# EAGLE schematic Inverter New (EAGLE 9.1.2)

## Sheet 1 of 3
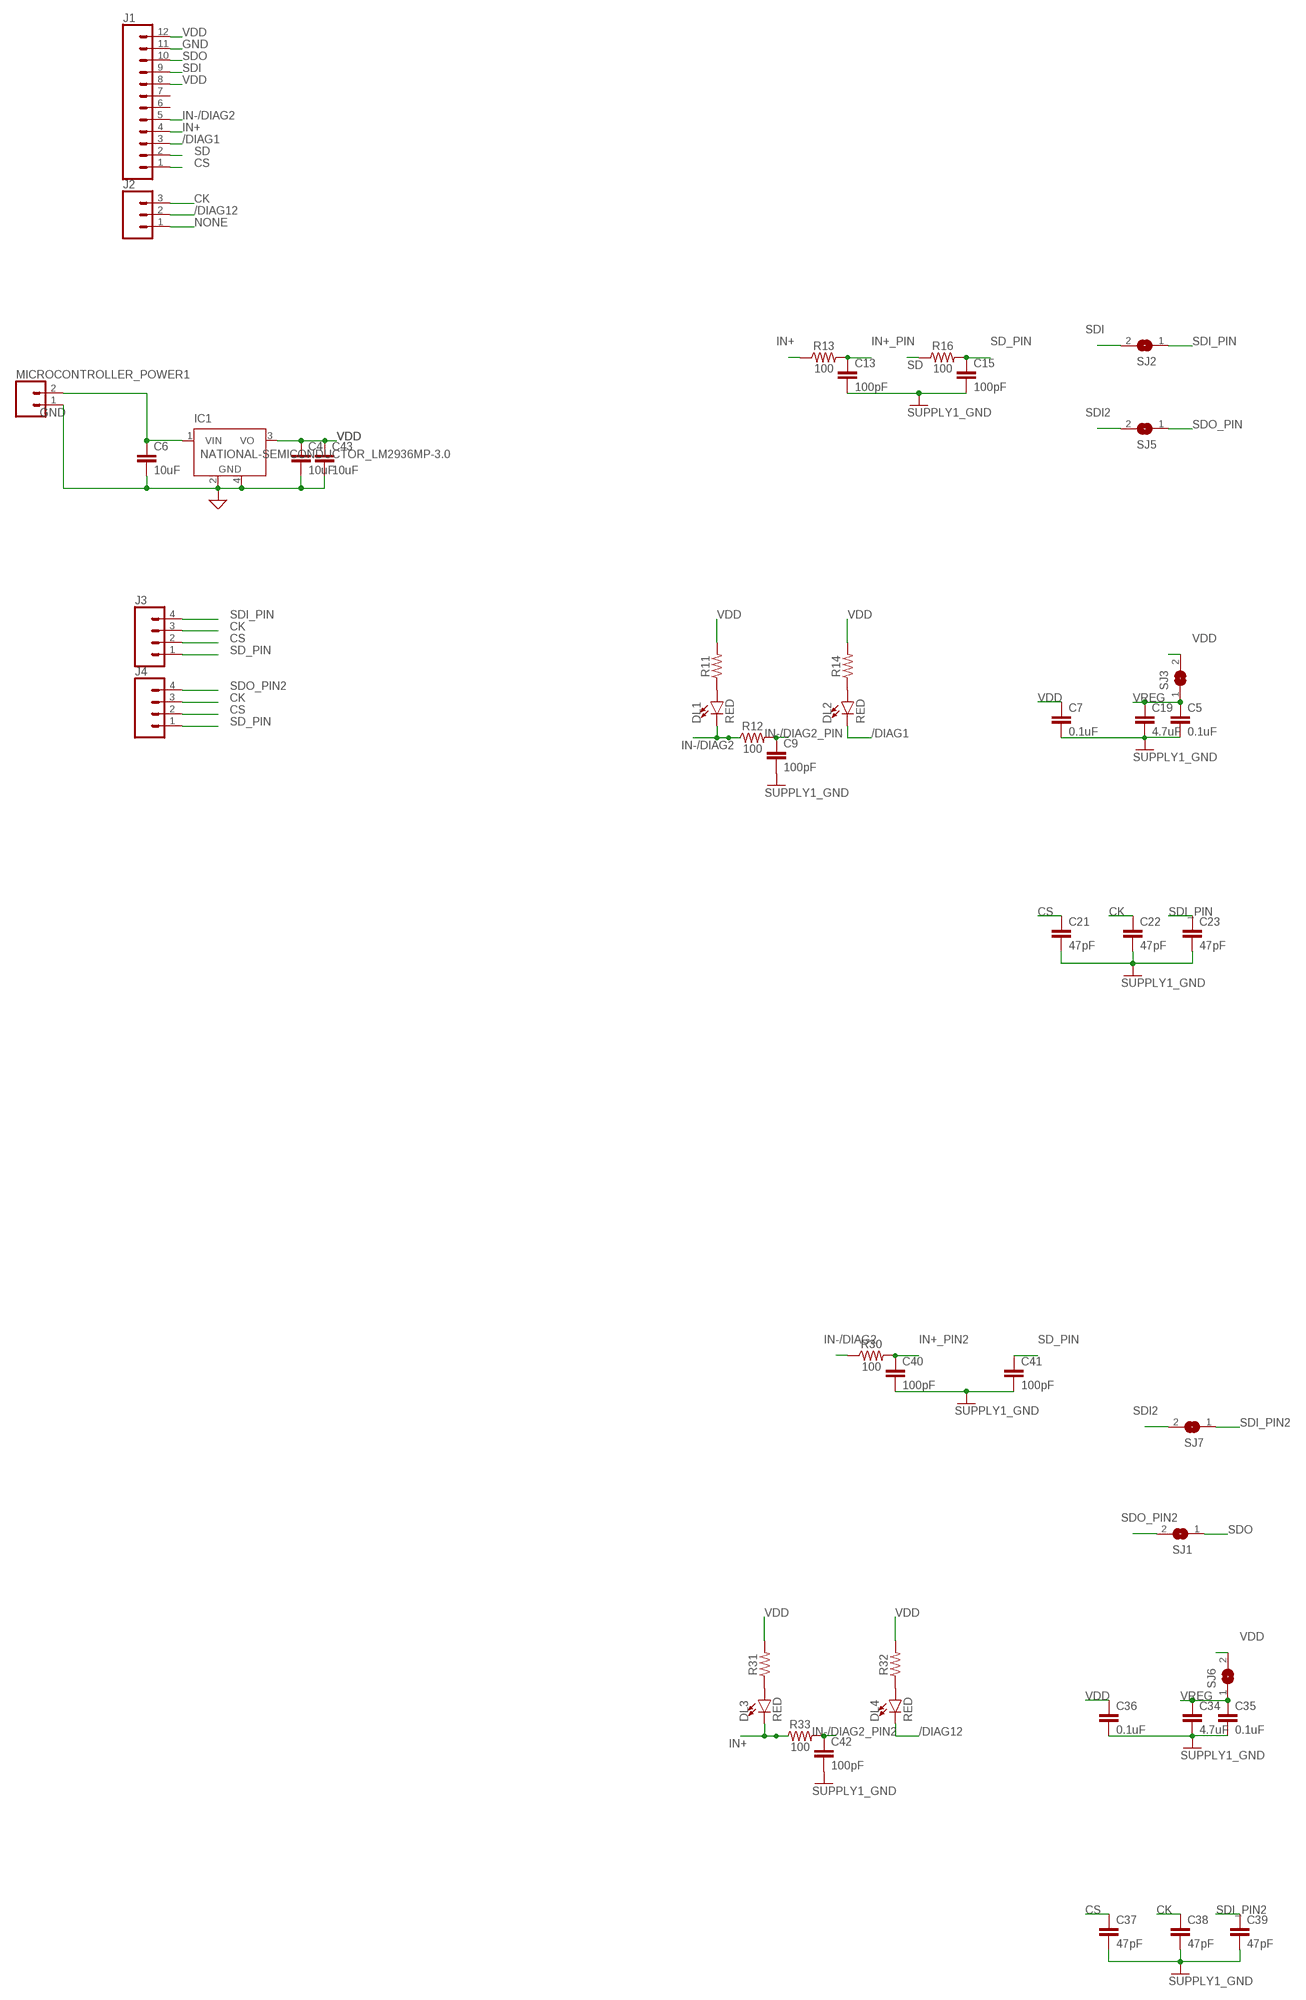
[diagram p0: schematic, sheet 1, part 1 of 2]
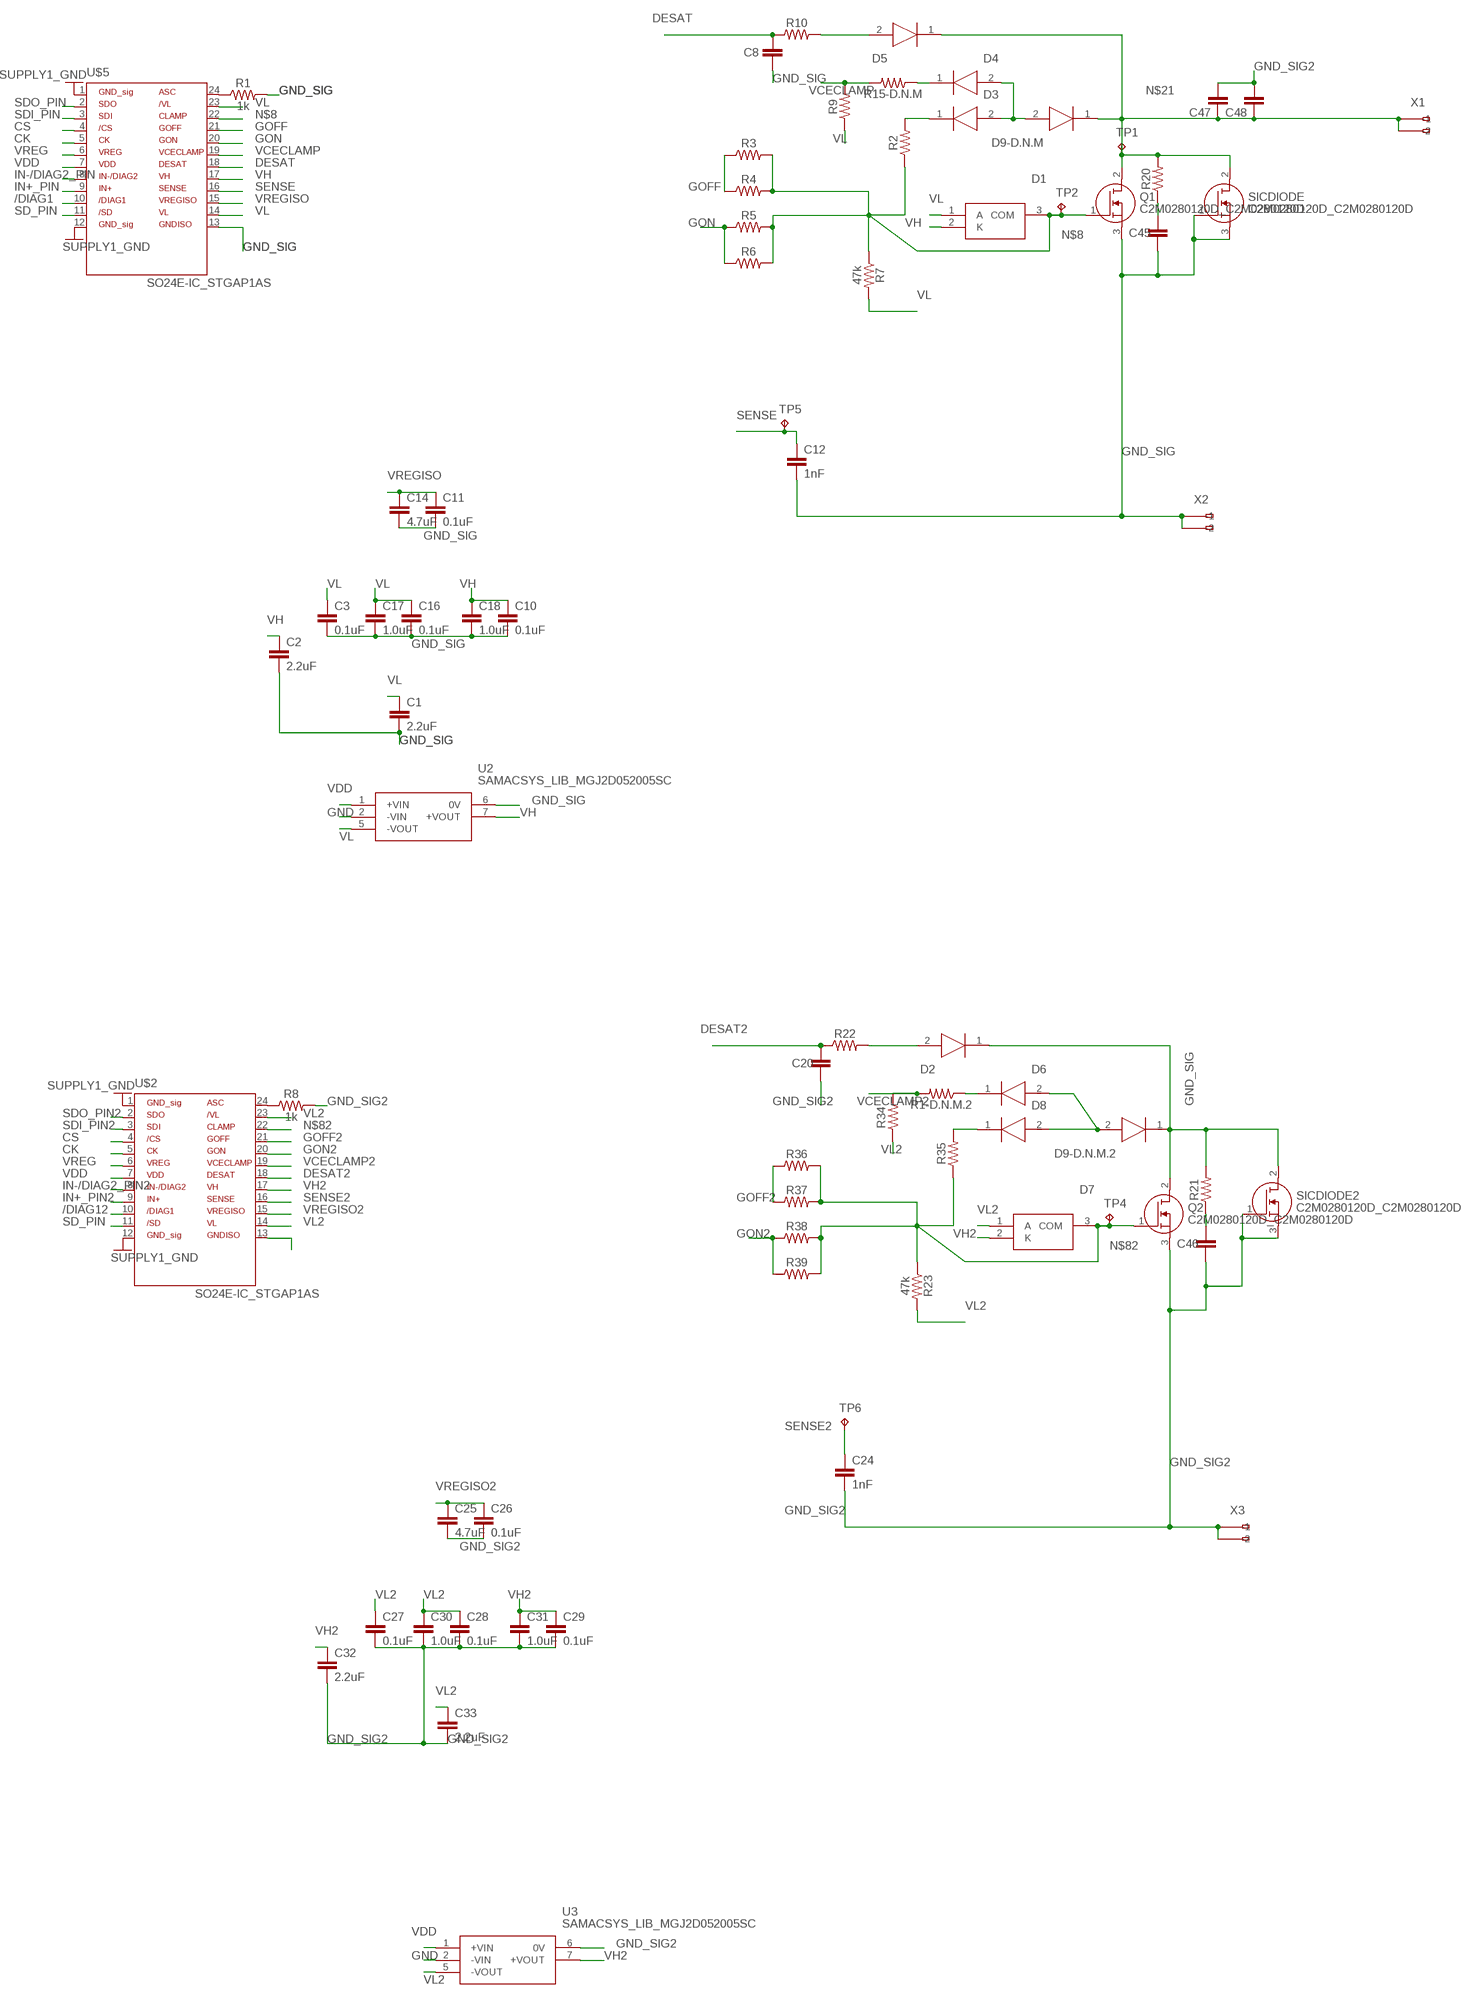
[diagram p1: schematic, sheet 1, part 2 of 2]

### Parts
C1  2.2uF  SPARKFUN-CAPACITORS_2.2UF-1206-50V-10%  [SPARKFUN-CAPACITORS_1206]
C2  2.2uF  SPARKFUN-CAPACITORS_2.2UF-1206-50V-10%  [SPARKFUN-CAPACITORS_1206]
C3  0.1uF  SPARKFUN-CAPACITORS_0.1UF-0603-100V-10%  [SPARKFUN-CAPACITORS_0603]
C4  10uF  SPARKFUN-CAPACITORS_10UF-1210-50V-20%  [SPARKFUN-CAPACITORS_1210]
C5  0.1uF  SPARKFUN-CAPACITORS_0.1UF-0603-100V-10%  [SPARKFUN-CAPACITORS_0603]
C6  10uF  SPARKFUN-CAPACITORS_10UF-1210-50V-20%  [SPARKFUN-CAPACITORS_1210]
C7  0.1uF  SPARKFUN-CAPACITORS_0.1UF-0603-100V-10%  [SPARKFUN-CAPACITORS_0603]
C8  100pF  SPARKFUN-CAPACITORS_100PF-0603-50V-5%  [SPARKFUN-CAPACITORS_0603]
C9  100pF  SPARKFUN-CAPACITORS_100PF-0603-50V-5%  [SPARKFUN-CAPACITORS_0603]
C10  0.1uF  SPARKFUN-CAPACITORS_0.1UF-0603-100V-10%  [SPARKFUN-CAPACITORS_0603]
C11  0.1uF  SPARKFUN-CAPACITORS_0.1UF-0603-100V-10%  [SPARKFUN-CAPACITORS_0603]
C12  1nF  SPARKFUN-CAPACITORS_1.0NF/1000PF-0603-50V-10%  [SPARKFUN-CAPACITORS_0603]
C13  100pF  SPARKFUN-CAPACITORS_100PF-0603-50V-5%  [SPARKFUN-CAPACITORS_0603]
C14  4.7uF  SPARKFUN-CAPACITORS_4.7UF0603  [SPARKFUN-CAPACITORS_0603]
C15  100pF  SPARKFUN-CAPACITORS_100PF-0603-50V-5%  [SPARKFUN-CAPACITORS_0603]
C16  0.1uF  SPARKFUN-CAPACITORS_0.1UF-0603-100V-10%  [SPARKFUN-CAPACITORS_0603]
C17  1.0uF  SPARKFUN-CAPACITORS_1.0UF-0805-25V-10%  [SPARKFUN-CAPACITORS_0805]
C18  1.0uF  SPARKFUN-CAPACITORS_1.0UF-0805-25V-10%  [SPARKFUN-CAPACITORS_0805]
C19  4.7uF  SPARKFUN-CAPACITORS_4.7UF0603  [SPARKFUN-CAPACITORS_0603]
C20  100pF  SPARKFUN-CAPACITORS_100PF-0603-50V-5%  [SPARKFUN-CAPACITORS_0603]
C21  47pF  SPARKFUN-CAPACITORS_47PF-0603-50V-5%  [SPARKFUN-CAPACITORS_0603]
C22  47pF  SPARKFUN-CAPACITORS_47PF-0603-50V-5%  [SPARKFUN-CAPACITORS_0603]
C23  47pF  SPARKFUN-CAPACITORS_47PF-0603-50V-5%  [SPARKFUN-CAPACITORS_0603]
C24  1nF  SPARKFUN-CAPACITORS_1.0NF/1000PF-0603-50V-10%  [SPARKFUN-CAPACITORS_0603]
C25  4.7uF  SPARKFUN-CAPACITORS_4.7UF0603  [SPARKFUN-CAPACITORS_0603]
C26  0.1uF  SPARKFUN-CAPACITORS_0.1UF-0603-100V-10%  [SPARKFUN-CAPACITORS_0603]
C27  0.1uF  SPARKFUN-CAPACITORS_0.1UF-0603-100V-10%  [SPARKFUN-CAPACITORS_0603]
C28  0.1uF  SPARKFUN-CAPACITORS_0.1UF-0603-100V-10%  [SPARKFUN-CAPACITORS_0603]
C29  0.1uF  SPARKFUN-CAPACITORS_0.1UF-0603-100V-10%  [SPARKFUN-CAPACITORS_0603]
C30  1.0uF  SPARKFUN-CAPACITORS_1.0UF-0805-25V-10%  [SPARKFUN-CAPACITORS_0805]
C31  1.0uF  SPARKFUN-CAPACITORS_1.0UF-0805-25V-10%  [SPARKFUN-CAPACITORS_0805]
C32  2.2uF  SPARKFUN-CAPACITORS_2.2UF-1206-50V-10%  [SPARKFUN-CAPACITORS_1206]
C33  2.2uF  SPARKFUN-CAPACITORS_2.2UF-1206-50V-10%  [SPARKFUN-CAPACITORS_1206]
C34  4.7uF  SPARKFUN-CAPACITORS_4.7UF0603  [SPARKFUN-CAPACITORS_0603]
C35  0.1uF  SPARKFUN-CAPACITORS_0.1UF-0603-100V-10%  [SPARKFUN-CAPACITORS_0603]
C36  0.1uF  SPARKFUN-CAPACITORS_0.1UF-0603-100V-10%  [SPARKFUN-CAPACITORS_0603]
C37  47pF  SPARKFUN-CAPACITORS_47PF-0603-50V-5%  [SPARKFUN-CAPACITORS_0603]
C38  47pF  SPARKFUN-CAPACITORS_47PF-0603-50V-5%  [SPARKFUN-CAPACITORS_0603]
C39  47pF  SPARKFUN-CAPACITORS_47PF-0603-50V-5%  [SPARKFUN-CAPACITORS_0603]
C40  100pF  SPARKFUN-CAPACITORS_100PF-0603-50V-5%  [SPARKFUN-CAPACITORS_0603]
C41  100pF  SPARKFUN-CAPACITORS_100PF-0603-50V-5%  [SPARKFUN-CAPACITORS_0603]
C42  100pF  SPARKFUN-CAPACITORS_100PF-0603-50V-5%  [SPARKFUN-CAPACITORS_0603]
C43  10uF  SPARKFUN-CAPACITORS_10UF-1210-50V-20%  [SPARKFUN-CAPACITORS_1210]
C45  100pF  SPARKFUN-CAPACITORS_100PF-0603-50V-5%  [SPARKFUN-CAPACITORS_0603]
C46  100pF  SPARKFUN-CAPACITORS_100PF-0603-50V-5%  [SPARKFUN-CAPACITORS_0603]
C47  C-EU225-062X268  [C225-062X268]
C48  C-EU225-062X268  [C225-062X268]
D1  BAT54SFILM_BAT54SFILM  [BAT54SFILM_SOT105P242X150-3N]
D2  STTH112A_STTH112A  [STTH112A_DIOM5126X265N]
D3  STPS2H100A_STPS2H100A  [STPS2H100A_DIOM5126X265N]
D4  BAT20JFILM_BAT20JFILM  [BAT20JFILM_SOD2512X113N]
D5  STTH112A_STTH112A  [STTH112A_DIOM5126X265N]
D6  BAT20JFILM_BAT20JFILM  [BAT20JFILM_SOD2512X113N]
D7  BAT54SFILM_BAT54SFILM  [BAT54SFILM_SOT105P242X150-3N]
D8  STPS2H100A_STPS2H100A  [STPS2H100A_DIOM5126X265N]
D9-D.N.M  STPS2H100A_STPS2H100A  [STPS2H100A_DIOM5126X265N]
D9-D.N.M.2  STPS2H100A_STPS2H100A  [STPS2H100A_DIOM5126X265N]
DL1  RED  SPARKFUN-LED_LED-RED1206  [SPARKFUN-LED_LED-1206]
DL2  RED  SPARKFUN-LED_LED-RED1206  [SPARKFUN-LED_LED-1206]
DL3  RED  SPARKFUN-LED_LED-RED1206  [SPARKFUN-LED_LED-1206]
DL4  RED  SPARKFUN-LED_LED-RED1206  [SPARKFUN-LED_LED-1206]
IC1  NATIONAL-SEMICONDUCTOR_LM2936MP-3.0  [NATIONAL-SEMICONDUCTOR_SOT223]
J1  SPARKFUN-CONNECTORS_CONN_12LONGPADS  [SPARKFUN-CONNECTORS_1X12_LONGPADS]
J2  SPARKFUN-CONNECTORS_CONN_03LONGPADS  [SPARKFUN-CONNECTORS_1X03_LONGPADS]
J3  SPARKFUN-CONNECTORS_CONN_04LONGPADS  [SPARKFUN-CONNECTORS_1X04_LONGPADS]
J4  SPARKFUN-CONNECTORS_CONN_04LONGPADS  [SPARKFUN-CONNECTORS_1X04_LONGPADS]
MICROCONTROLLER_POWER1  SPARKFUN-CONNECTORS_CONN_025MM  [SPARKFUN-CONNECTORS_SCREWTERMINAL-5MM-2]
Q1  C2M0280120D_C2M0280120D  [C2M0280120D_TO544P521X1594X2550-3P]
Q2  C2M0280120D_C2M0280120D  [C2M0280120D_TO544P521X1594X2550-3P]
R1  1k  SPARKFUN-RESISTORS_1KOHM-0603-1/10W-1%  [SPARKFUN-RESISTORS_0603]
R1-D.N.M.2  0  SPARKFUN-RESISTORS_0OHM-0603-1/10W-5%  [SPARKFUN-RESISTORS_0603]
R2  SPARKFUN-RESISTORS_RESISTOR0805  [SPARKFUN-RESISTORS_0805]
R3  SPARKFUN-RESISTORS_RESISTOR1206  [SPARKFUN-RESISTORS_1206]
R4  SPARKFUN-RESISTORS_RESISTOR1206  [SPARKFUN-RESISTORS_1206]
R5  SPARKFUN-RESISTORS_RESISTOR1206  [SPARKFUN-RESISTORS_1206]
R6  SPARKFUN-RESISTORS_RESISTOR1206  [SPARKFUN-RESISTORS_1206]
R7  47k  SPARKFUN-RESISTORS_47KOHM-0603-1/10W-1%  [SPARKFUN-RESISTORS_0603]
R8  1k  SPARKFUN-RESISTORS_1KOHM-0603-1/10W-1%  [SPARKFUN-RESISTORS_0603]
R9  0  SPARKFUN-RESISTORS_0OHM-0603-1/10W-5%  [SPARKFUN-RESISTORS_0603]
R10  1k  SPARKFUN-RESISTORS_1KOHM-0603-1/10W-1%  [SPARKFUN-RESISTORS_0603]
R11  SPARKFUN-RESISTORS_RESISTOR0603  [SPARKFUN-RESISTORS_0603]
R12  100  SPARKFUN-RESISTORS_100OHM-0603-1/4W-5%  [SPARKFUN-RESISTORS_0603]
R13  100  SPARKFUN-RESISTORS_100OHM-0603-1/4W-5%  [SPARKFUN-RESISTORS_0603]
R14  SPARKFUN-RESISTORS_RESISTOR0603  [SPARKFUN-RESISTORS_0603]
R15-D.N.M  0  SPARKFUN-RESISTORS_0OHM-0603-1/10W-5%  [SPARKFUN-RESISTORS_0603]
R16  100  SPARKFUN-RESISTORS_100OHM-0603-1/4W-5%  [SPARKFUN-RESISTORS_0603]
R20  SPARKFUN-RESISTORS_RESISTOR1206  [SPARKFUN-RESISTORS_1206]
R21  SPARKFUN-RESISTORS_RESISTOR1206  [SPARKFUN-RESISTORS_1206]
R22  1k  SPARKFUN-RESISTORS_1KOHM-0603-1/10W-1%  [SPARKFUN-RESISTORS_0603]
R23  47k  SPARKFUN-RESISTORS_47KOHM-0603-1/10W-1%  [SPARKFUN-RESISTORS_0603]
R30  100  SPARKFUN-RESISTORS_100OHM-0603-1/4W-5%  [SPARKFUN-RESISTORS_0603]
R31  SPARKFUN-RESISTORS_RESISTOR0603  [SPARKFUN-RESISTORS_0603]
R32  SPARKFUN-RESISTORS_RESISTOR0603  [SPARKFUN-RESISTORS_0603]
R33  100  SPARKFUN-RESISTORS_100OHM-0603-1/4W-5%  [SPARKFUN-RESISTORS_0603]
R34  0  SPARKFUN-RESISTORS_0OHM-0603-1/10W-5%  [SPARKFUN-RESISTORS_0603]
R35  SPARKFUN-RESISTORS_RESISTOR0805  [SPARKFUN-RESISTORS_0805]
R36  SPARKFUN-RESISTORS_RESISTOR1206  [SPARKFUN-RESISTORS_1206]
R37  SPARKFUN-RESISTORS_RESISTOR1206  [SPARKFUN-RESISTORS_1206]
R38  SPARKFUN-RESISTORS_RESISTOR1206  [SPARKFUN-RESISTORS_1206]
R39  SPARKFUN-RESISTORS_RESISTOR1206  [SPARKFUN-RESISTORS_1206]
SICDIODE  C2M0280120D_C2M0280120D  [C2M0280120D_TO544P521X1594X2550-3P]
SICDIODE2  C2M0280120D_C2M0280120D  [C2M0280120D_TO544P521X1594X2550-3P]
SJ1  JUMPER_SJ  [JUMPER_SJ]
SJ2  JUMPER_SJ  [JUMPER_SJ]
SJ3  JUMPER_SJ  [JUMPER_SJ]
SJ5  JUMPER_SJ  [JUMPER_SJ]
SJ6  JUMPER_SJ  [JUMPER_SJ]
SJ7  JUMPER_SJ  [JUMPER_SJ]
TP1  TPTP15SQ  [TP15SQ]
TP2  TPTP15SQ  [TP15SQ]
TP4  TPTP15SQ  [TP15SQ]
TP5  TPTP15SQ  [TP15SQ]
TP6  TPTP15SQ  [TP15SQ]
U2  SAMACSYS_LIB_MGJ2D052005SC  [SAMACSYS_LIB_MGJ2D_7-PIN-SIP]
U3  SAMACSYS_LIB_MGJ2D052005SC  [SAMACSYS_LIB_MGJ2D_7-PIN-SIP]
U$2  SO24E-IC_STGAP1AS  [SO24E-IC_SO24W]
U$5  SO24E-IC_STGAP1AS  [SO24E-IC_SO24W]
X1  234-502  [234-502]
X2  234-502  [234-502]
X3  234-502  [234-502]

### Nets
/DIAG1: DL2.C J1.3 U$5.10(/DIAG1)
/DIAG12: DL4.C J2.2 U$2.10(/DIAG1)
CK: C22.1 C38.1 J2.3 J3.3 J4.3 U$2.5(CK) U$5.5(CK)
CS: C21.1 C37.1 J1.1 J3.2 J4.2 U$2.4(/CS) U$5.4(/CS)
DESAT: C8.1 R10.1 U$5.18(DESAT)
DESAT2: C20.1 R22.1 U$2.18(DESAT)
GND: C4.2 C5.2 C6.2 C7.2 C9.2 C13.2 C15.2 C19.2 C21.2 C22.2 C23.2 C34.2 C35.2 C36.2 C37.2 C38.2 C39.2 C40.2 C41.2 C42.2 C43.2 IC1.2(GND) IC1.4(GND) J1.11 MICROCONTROLLER_POWER1.1 U2.2(-VIN) U3.2(-VIN) U$2.1(GND_SIG) U$2.12(GND_SIG) U$5.1(GND_SIG) U$5.12(GND_SIG) ; supply symbol labelled SUPPLY1_GND, SUP ; also sheet 2
GND_SIG: C1.2 C2.2 C3.2 C8.2 C10.2 C11.2 C12.2 C14.2 C16.2 C17.2 C18.2 C45.2 D2.1(K) D9-D.N.M.2.1(K) Q1.3(S) Q2.2(D) R1.2 R21.2 SICDIODE2.2(D) SICDIODE.1(G) SICDIODE.3(S) U2.6(0V) U$5.13(GNDISO) X2.A1(-1) X2.A2(-2)
GND_SIG2: C20.2 C24.2 C25.2 C26.2 C27.2 C28.2 C29.2 C30.2 C31.2 C32.2 C33.2 C46.2 C47.2 C48.2 Q2.3(S) R8.2 SICDIODE2.1(G) SICDIODE2.3(S) U3.6(0V) U$2.13(GNDISO) X3.A1(-1) X3.A2(-2)
GOFF: R3.1 R4.1 U$5.21(GOFF)
GOFF2: R36.1 R37.1 U$2.21(GOFF)
GON: R5.1 R6.1 U$5.20(GON)
GON2: R38.1 R39.1 U$2.20(GON)
IN+: DL3.C J1.4 R13.1 R33.1
IN+_PIN: C13.1 R13.2 U$5.9(IN+)
IN+_PIN2: C40.1 R30.2 U$2.9(IN+)
IN-/DIAG2: DL1.C J1.5 R12.1 R30.1
IN-/DIAG2_PIN: C9.1 R12.2 U$5.8(IN-/DIAG2)
IN-/DIAG2_PIN2: C42.1 R33.2 U$2.8(IN-/DIAG2)
N$1: R1.1 U$5.24(ASC)
N$2: DL1.A R11.1
N$3: DL2.A R14.1
N$4: D5.2(A) R10.2
N$5: D2.2(A) R22.2
N$7: D3.1(K) R2.2
N$8: D1.3(COM) Q1.1(G) R2.1 R3.2 R4.2 R5.2 R6.2 R7.1 TP2.TP U$5.22(CLAMP)
N$11: C6.1 IC1.1(VIN) MICROCONTROLLER_POWER1.2
N$12: D8.1(K) R35.2
N$13: R8.1 U$2.24(ASC)
N$14: DL3.A R31.1
N$15: DL4.A R32.1
N$16: D4.1(K) R15-D.N.M.1
N$18: D3.2(A) D4.2(A) D9-D.N.M.2(A)
N$19: D6.1(K) R1-D.N.M.2.1
N$20: D6.2(A) D8.2(A) D9-D.N.M.2.2(A)
N$21: C47.1 C48.1 D5.1(K) D9-D.N.M.1(K) Q1.2(D) R20.2 SICDIODE.2(D) TP1.TP X1.A1(-1) X1.A2(-2)
N$28: C45.1 R20.1
N$32: C46.1 R21.1
N$82: D7.3(COM) Q2.1(G) R23.1 R35.1 R36.2 R37.2 R38.2 R39.2 TP4.TP U$2.22(CLAMP)
NONE: J2.1
SD: J1.2 R16.1
SD_PIN: C15.1 C41.1 J3.1 J4.1 R16.2 U$2.11(/SD) U$5.11(/SD)
SDI: J1.9 SJ2.2
SDI2: SJ5.2 SJ7.2
SDI_PIN: C23.1 J3.4 SJ2.1 U$5.3(SDI)
SDI_PIN2: C39.1 SJ7.1 U$2.3(SDI)
SDO: J1.10 SJ1.1
SDO_PIN: SJ5.1 U$5.2(SDO)
SDO_PIN2: J4.4 SJ1.2 U$2.2(SDO) ; also sheet 2
SENSE: C12.1 TP5.TP U$5.16(SENSE)
SENSE2: C24.1 TP6.TP U$2.16(SENSE)
VCECLAMP: R9.2 R15-D.N.M.2 U$5.19(VCECLAMP)
VCECLAMP2: R1-D.N.M.2.2 R34.2 U$2.19(VCECLAMP)
VDD: C4.1 C7.1 C36.1 C43.1 IC1.3(VO) J1.8 J1.12 R11.2 R14.2 R31.2 R32.2 SJ3.2 SJ6.2 U2.1(+VIN) U3.1(+VIN) U$2.7(VDD) U$5.7(VDD) ; also sheet 2
VH: C2.1 C10.1 C18.1 D1.2(K) U2.7(+VOUT) U$5.17(VH)
VH2: C29.1 C31.1 C32.1 D7.2(K) U3.7(+VOUT) U$2.17(VH)
VL: C1.1 C3.1 C16.1 C17.1 D1.1(A) R7.2 R9.1 U2.5(-VOUT) U$5.14(VL) U$5.23(VL)
VL2: C27.1 C28.1 C30.1 C33.1 D7.1(A) R23.2 R34.1 U3.5(-VOUT) U$2.14(VL) U$2.23(VL)
VREG: C5.1 C19.1 C34.1 C35.1 SJ3.1 SJ6.1 U$2.6(VREG) U$5.6(VREG)
VREGISO: C11.1 C14.1 U$5.15(VREGISO)
VREGISO2: C25.1 C26.1 U$2.15(VREGISO)
Unconnected: J1.6 J1.7 X1.B1(B-1) X1.B2(B-2) X2.B1(B-1) X2.B2(B-2) X3.B1(B-1) X3.B2(B-2)

## Sheet 2 of 3
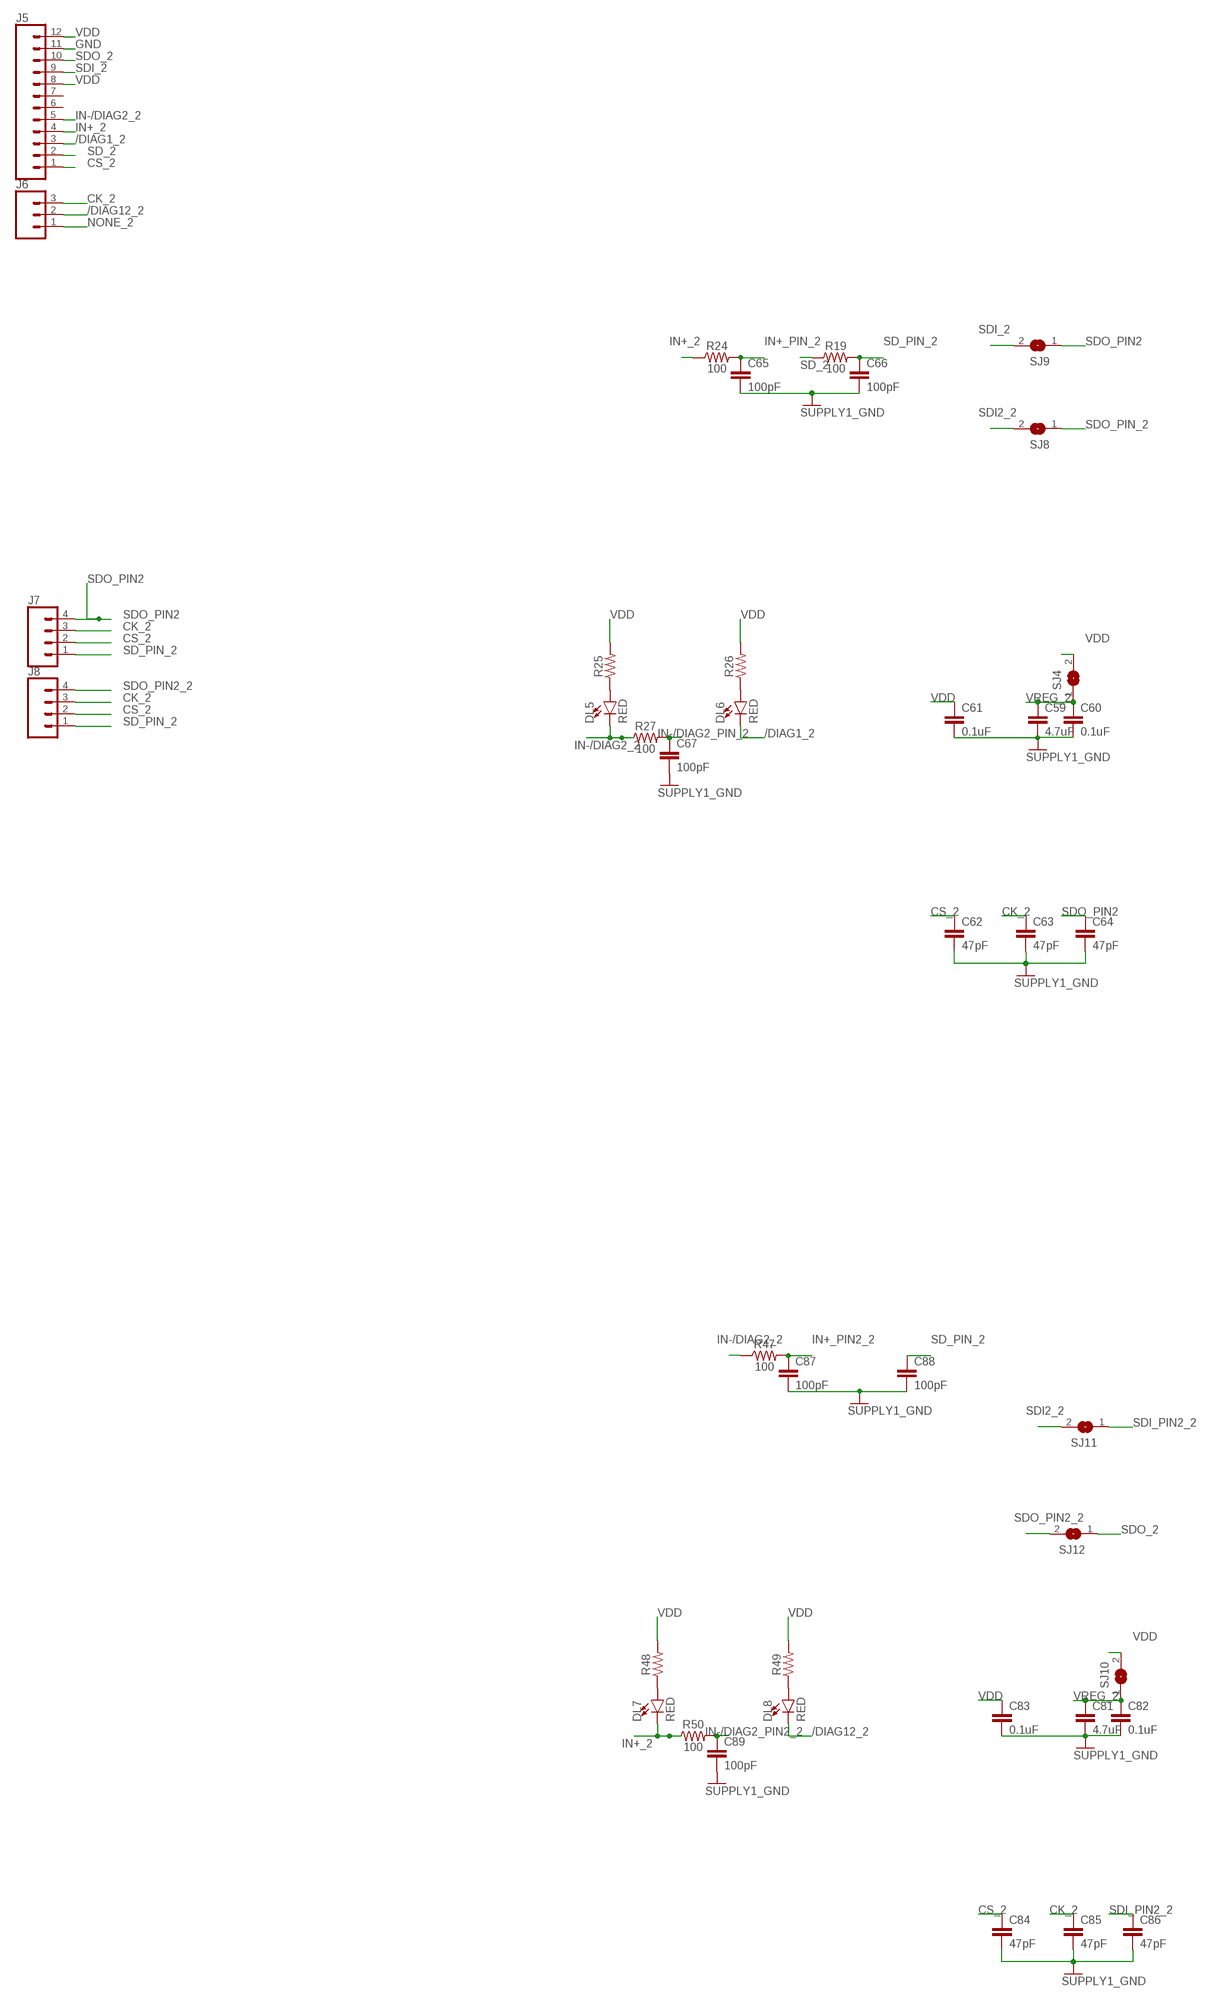
[diagram p2: schematic, sheet 2, part 1 of 2]
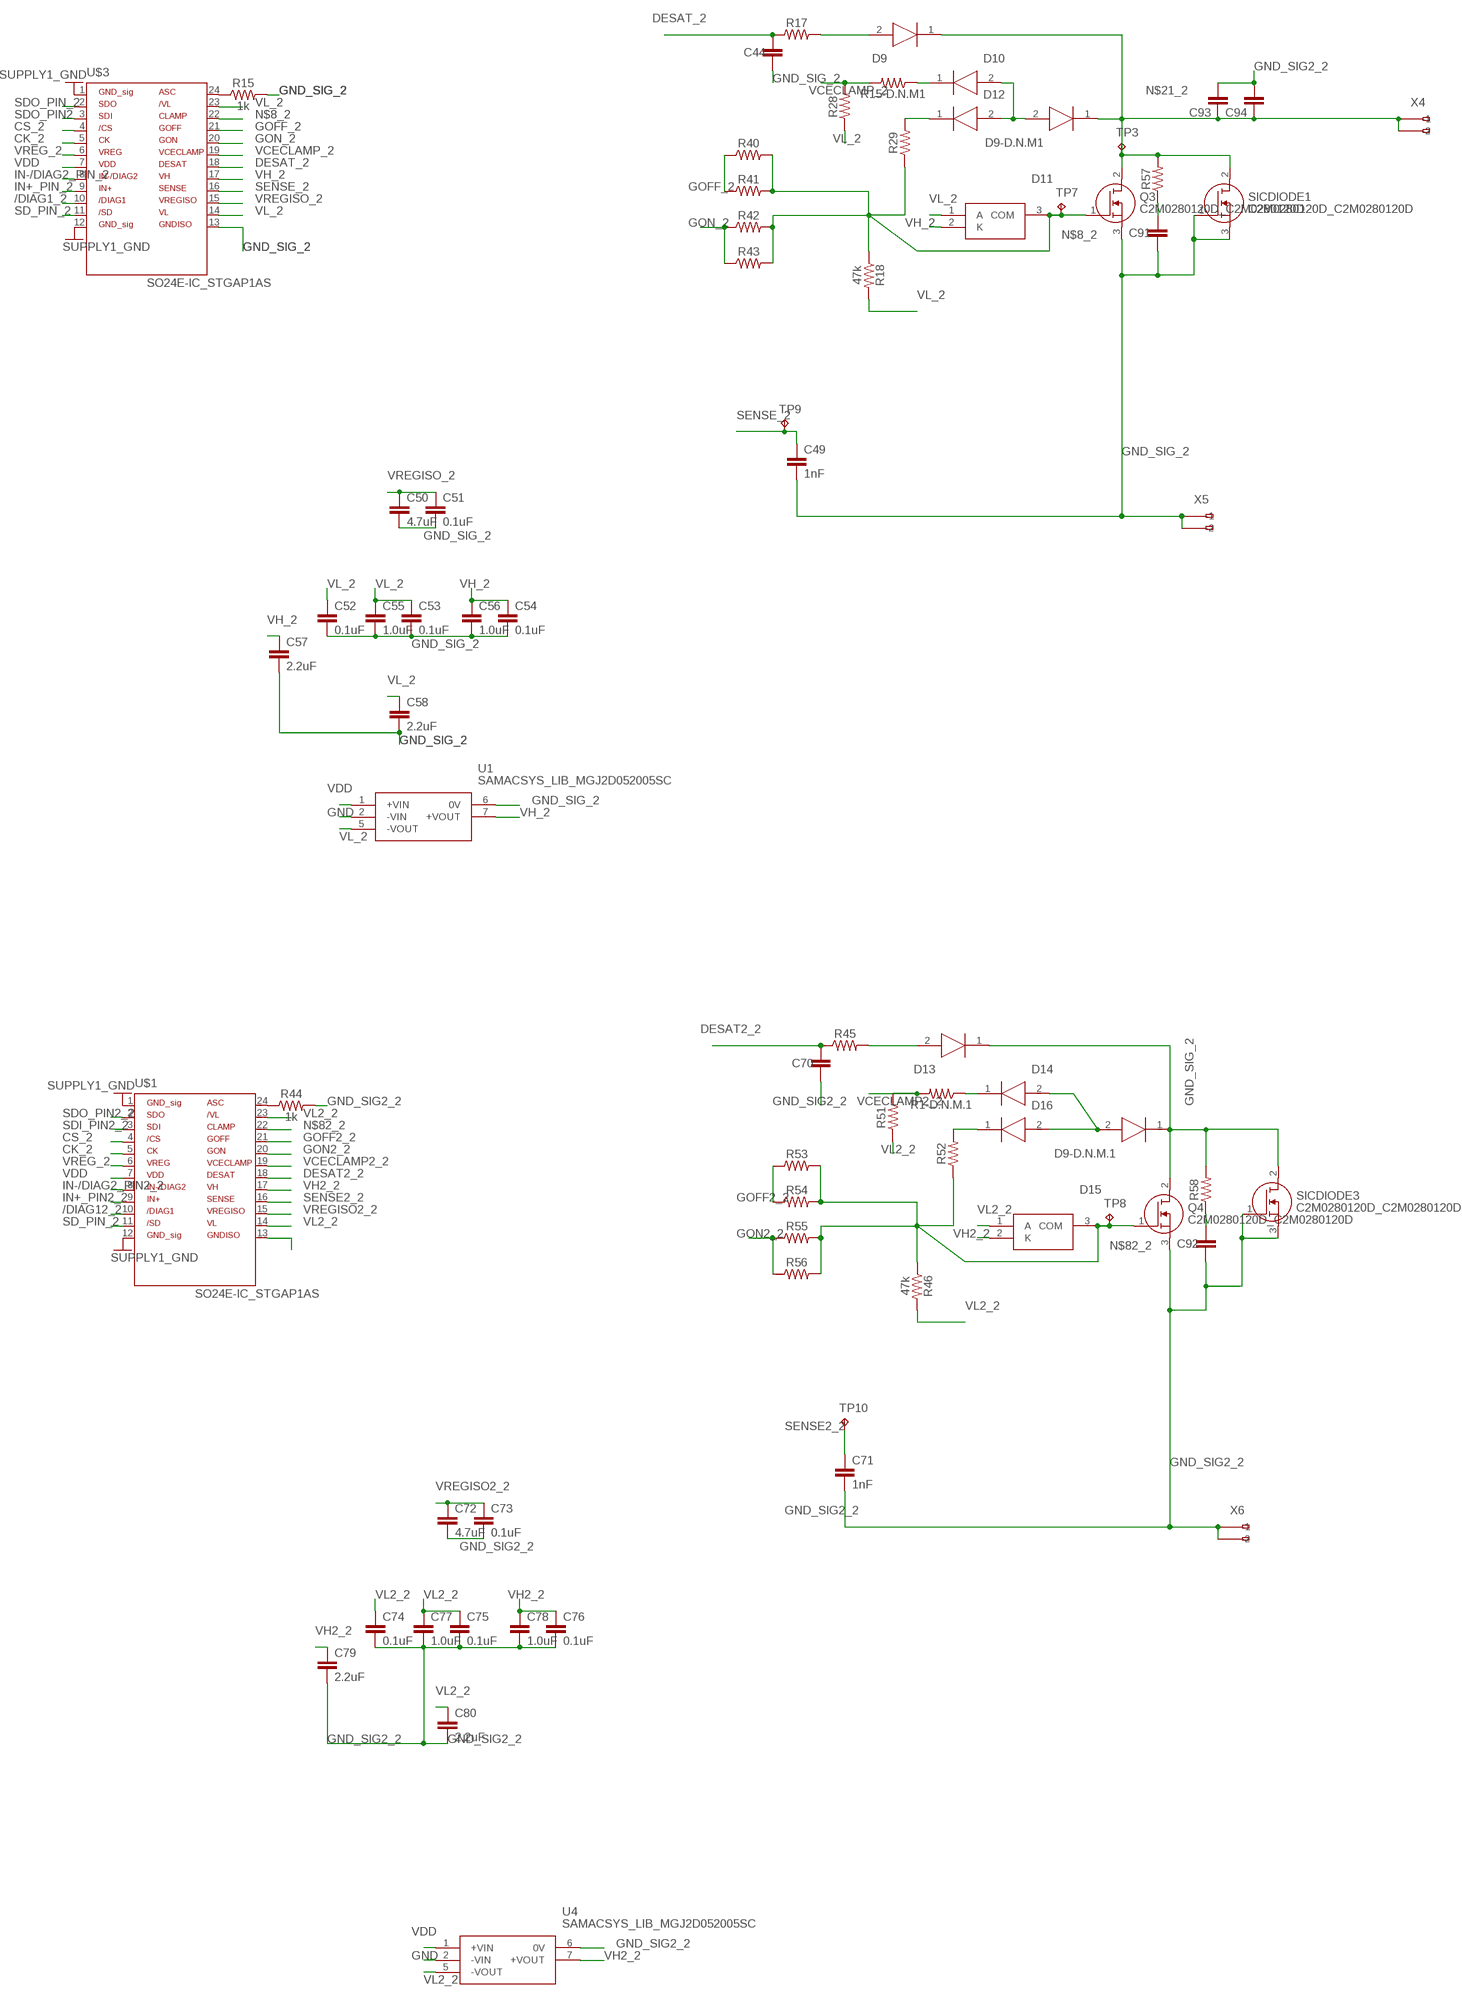
[diagram p3: schematic, sheet 2, part 2 of 2]

### Parts
C44  100pF  SPARKFUN-CAPACITORS_100PF-0603-50V-5%  [SPARKFUN-CAPACITORS_0603]
C49  1nF  SPARKFUN-CAPACITORS_1.0NF/1000PF-0603-50V-10%  [SPARKFUN-CAPACITORS_0603]
C50  4.7uF  SPARKFUN-CAPACITORS_4.7UF0603  [SPARKFUN-CAPACITORS_0603]
C51  0.1uF  SPARKFUN-CAPACITORS_0.1UF-0603-100V-10%  [SPARKFUN-CAPACITORS_0603]
C52  0.1uF  SPARKFUN-CAPACITORS_0.1UF-0603-100V-10%  [SPARKFUN-CAPACITORS_0603]
C53  0.1uF  SPARKFUN-CAPACITORS_0.1UF-0603-100V-10%  [SPARKFUN-CAPACITORS_0603]
C54  0.1uF  SPARKFUN-CAPACITORS_0.1UF-0603-100V-10%  [SPARKFUN-CAPACITORS_0603]
C55  1.0uF  SPARKFUN-CAPACITORS_1.0UF-0805-25V-10%  [SPARKFUN-CAPACITORS_0805]
C56  1.0uF  SPARKFUN-CAPACITORS_1.0UF-0805-25V-10%  [SPARKFUN-CAPACITORS_0805]
C57  2.2uF  SPARKFUN-CAPACITORS_2.2UF-1206-50V-10%  [SPARKFUN-CAPACITORS_1206]
C58  2.2uF  SPARKFUN-CAPACITORS_2.2UF-1206-50V-10%  [SPARKFUN-CAPACITORS_1206]
C59  4.7uF  SPARKFUN-CAPACITORS_4.7UF0603  [SPARKFUN-CAPACITORS_0603]
C60  0.1uF  SPARKFUN-CAPACITORS_0.1UF-0603-100V-10%  [SPARKFUN-CAPACITORS_0603]
C61  0.1uF  SPARKFUN-CAPACITORS_0.1UF-0603-100V-10%  [SPARKFUN-CAPACITORS_0603]
C62  47pF  SPARKFUN-CAPACITORS_47PF-0603-50V-5%  [SPARKFUN-CAPACITORS_0603]
C63  47pF  SPARKFUN-CAPACITORS_47PF-0603-50V-5%  [SPARKFUN-CAPACITORS_0603]
C64  47pF  SPARKFUN-CAPACITORS_47PF-0603-50V-5%  [SPARKFUN-CAPACITORS_0603]
C65  100pF  SPARKFUN-CAPACITORS_100PF-0603-50V-5%  [SPARKFUN-CAPACITORS_0603]
C66  100pF  SPARKFUN-CAPACITORS_100PF-0603-50V-5%  [SPARKFUN-CAPACITORS_0603]
C67  100pF  SPARKFUN-CAPACITORS_100PF-0603-50V-5%  [SPARKFUN-CAPACITORS_0603]
C70  100pF  SPARKFUN-CAPACITORS_100PF-0603-50V-5%  [SPARKFUN-CAPACITORS_0603]
C71  1nF  SPARKFUN-CAPACITORS_1.0NF/1000PF-0603-50V-10%  [SPARKFUN-CAPACITORS_0603]
C72  4.7uF  SPARKFUN-CAPACITORS_4.7UF0603  [SPARKFUN-CAPACITORS_0603]
C73  0.1uF  SPARKFUN-CAPACITORS_0.1UF-0603-100V-10%  [SPARKFUN-CAPACITORS_0603]
C74  0.1uF  SPARKFUN-CAPACITORS_0.1UF-0603-100V-10%  [SPARKFUN-CAPACITORS_0603]
C75  0.1uF  SPARKFUN-CAPACITORS_0.1UF-0603-100V-10%  [SPARKFUN-CAPACITORS_0603]
C76  0.1uF  SPARKFUN-CAPACITORS_0.1UF-0603-100V-10%  [SPARKFUN-CAPACITORS_0603]
C77  1.0uF  SPARKFUN-CAPACITORS_1.0UF-0805-25V-10%  [SPARKFUN-CAPACITORS_0805]
C78  1.0uF  SPARKFUN-CAPACITORS_1.0UF-0805-25V-10%  [SPARKFUN-CAPACITORS_0805]
C79  2.2uF  SPARKFUN-CAPACITORS_2.2UF-1206-50V-10%  [SPARKFUN-CAPACITORS_1206]
C80  2.2uF  SPARKFUN-CAPACITORS_2.2UF-1206-50V-10%  [SPARKFUN-CAPACITORS_1206]
C81  4.7uF  SPARKFUN-CAPACITORS_4.7UF0603  [SPARKFUN-CAPACITORS_0603]
C82  0.1uF  SPARKFUN-CAPACITORS_0.1UF-0603-100V-10%  [SPARKFUN-CAPACITORS_0603]
C83  0.1uF  SPARKFUN-CAPACITORS_0.1UF-0603-100V-10%  [SPARKFUN-CAPACITORS_0603]
C84  47pF  SPARKFUN-CAPACITORS_47PF-0603-50V-5%  [SPARKFUN-CAPACITORS_0603]
C85  47pF  SPARKFUN-CAPACITORS_47PF-0603-50V-5%  [SPARKFUN-CAPACITORS_0603]
C86  47pF  SPARKFUN-CAPACITORS_47PF-0603-50V-5%  [SPARKFUN-CAPACITORS_0603]
C87  100pF  SPARKFUN-CAPACITORS_100PF-0603-50V-5%  [SPARKFUN-CAPACITORS_0603]
C88  100pF  SPARKFUN-CAPACITORS_100PF-0603-50V-5%  [SPARKFUN-CAPACITORS_0603]
C89  100pF  SPARKFUN-CAPACITORS_100PF-0603-50V-5%  [SPARKFUN-CAPACITORS_0603]
C91  100pF  SPARKFUN-CAPACITORS_100PF-0603-50V-5%  [SPARKFUN-CAPACITORS_0603]
C92  100pF  SPARKFUN-CAPACITORS_100PF-0603-50V-5%  [SPARKFUN-CAPACITORS_0603]
C93  C-EU225-062X268  [C225-062X268]
C94  C-EU225-062X268  [C225-062X268]
D9  STTH112A_STTH112A  [STTH112A_DIOM5126X265N]
D9-D.N.M1  STPS2H100A_STPS2H100A  [STPS2H100A_DIOM5126X265N]
D9-D.N.M.1  STPS2H100A_STPS2H100A  [STPS2H100A_DIOM5126X265N]
D10  BAT20JFILM_BAT20JFILM  [BAT20JFILM_SOD2512X113N]
D11  BAT54SFILM_BAT54SFILM  [BAT54SFILM_SOT105P242X150-3N]
D12  STPS2H100A_STPS2H100A  [STPS2H100A_DIOM5126X265N]
D13  STTH112A_STTH112A  [STTH112A_DIOM5126X265N]
D14  BAT20JFILM_BAT20JFILM  [BAT20JFILM_SOD2512X113N]
D15  BAT54SFILM_BAT54SFILM  [BAT54SFILM_SOT105P242X150-3N]
D16  STPS2H100A_STPS2H100A  [STPS2H100A_DIOM5126X265N]
DL5  RED  SPARKFUN-LED_LED-RED1206  [SPARKFUN-LED_LED-1206]
DL6  RED  SPARKFUN-LED_LED-RED1206  [SPARKFUN-LED_LED-1206]
DL7  RED  SPARKFUN-LED_LED-RED1206  [SPARKFUN-LED_LED-1206]
DL8  RED  SPARKFUN-LED_LED-RED1206  [SPARKFUN-LED_LED-1206]
J5  SPARKFUN-CONNECTORS_CONN_12LONGPADS  [SPARKFUN-CONNECTORS_1X12_LONGPADS]
J6  SPARKFUN-CONNECTORS_CONN_03LONGPADS  [SPARKFUN-CONNECTORS_1X03_LONGPADS]
J7  SPARKFUN-CONNECTORS_CONN_04LONGPADS  [SPARKFUN-CONNECTORS_1X04_LONGPADS]
J8  SPARKFUN-CONNECTORS_CONN_04LONGPADS  [SPARKFUN-CONNECTORS_1X04_LONGPADS]
Q3  C2M0280120D_C2M0280120D  [C2M0280120D_TO544P521X1594X2550-3P]
Q4  C2M0280120D_C2M0280120D  [C2M0280120D_TO544P521X1594X2550-3P]
R1-D.N.M.1  0  SPARKFUN-RESISTORS_0OHM-0603-1/10W-5%  [SPARKFUN-RESISTORS_0603]
R15  1k  SPARKFUN-RESISTORS_1KOHM-0603-1/10W-1%  [SPARKFUN-RESISTORS_0603]
R15-D.N.M1  0  SPARKFUN-RESISTORS_0OHM-0603-1/10W-5%  [SPARKFUN-RESISTORS_0603]
R17  1k  SPARKFUN-RESISTORS_1KOHM-0603-1/10W-1%  [SPARKFUN-RESISTORS_0603]
R18  47k  SPARKFUN-RESISTORS_47KOHM-0603-1/10W-1%  [SPARKFUN-RESISTORS_0603]
R19  100  SPARKFUN-RESISTORS_100OHM-0603-1/4W-5%  [SPARKFUN-RESISTORS_0603]
R24  100  SPARKFUN-RESISTORS_100OHM-0603-1/4W-5%  [SPARKFUN-RESISTORS_0603]
R25  SPARKFUN-RESISTORS_RESISTOR0603  [SPARKFUN-RESISTORS_0603]
R26  SPARKFUN-RESISTORS_RESISTOR0603  [SPARKFUN-RESISTORS_0603]
R27  100  SPARKFUN-RESISTORS_100OHM-0603-1/4W-5%  [SPARKFUN-RESISTORS_0603]
R28  0  SPARKFUN-RESISTORS_0OHM-0603-1/10W-5%  [SPARKFUN-RESISTORS_0603]
R29  SPARKFUN-RESISTORS_RESISTOR0805  [SPARKFUN-RESISTORS_0805]
R40  SPARKFUN-RESISTORS_RESISTOR1206  [SPARKFUN-RESISTORS_1206]
R41  SPARKFUN-RESISTORS_RESISTOR1206  [SPARKFUN-RESISTORS_1206]
R42  SPARKFUN-RESISTORS_RESISTOR1206  [SPARKFUN-RESISTORS_1206]
R43  SPARKFUN-RESISTORS_RESISTOR1206  [SPARKFUN-RESISTORS_1206]
R44  1k  SPARKFUN-RESISTORS_1KOHM-0603-1/10W-1%  [SPARKFUN-RESISTORS_0603]
R45  1k  SPARKFUN-RESISTORS_1KOHM-0603-1/10W-1%  [SPARKFUN-RESISTORS_0603]
R46  47k  SPARKFUN-RESISTORS_47KOHM-0603-1/10W-1%  [SPARKFUN-RESISTORS_0603]
R47  100  SPARKFUN-RESISTORS_100OHM-0603-1/4W-5%  [SPARKFUN-RESISTORS_0603]
R48  SPARKFUN-RESISTORS_RESISTOR0603  [SPARKFUN-RESISTORS_0603]
R49  SPARKFUN-RESISTORS_RESISTOR0603  [SPARKFUN-RESISTORS_0603]
R50  100  SPARKFUN-RESISTORS_100OHM-0603-1/4W-5%  [SPARKFUN-RESISTORS_0603]
R51  0  SPARKFUN-RESISTORS_0OHM-0603-1/10W-5%  [SPARKFUN-RESISTORS_0603]
R52  SPARKFUN-RESISTORS_RESISTOR0805  [SPARKFUN-RESISTORS_0805]
R53  SPARKFUN-RESISTORS_RESISTOR1206  [SPARKFUN-RESISTORS_1206]
R54  SPARKFUN-RESISTORS_RESISTOR1206  [SPARKFUN-RESISTORS_1206]
R55  SPARKFUN-RESISTORS_RESISTOR1206  [SPARKFUN-RESISTORS_1206]
R56  SPARKFUN-RESISTORS_RESISTOR1206  [SPARKFUN-RESISTORS_1206]
R57  SPARKFUN-RESISTORS_RESISTOR1206  [SPARKFUN-RESISTORS_1206]
R58  SPARKFUN-RESISTORS_RESISTOR1206  [SPARKFUN-RESISTORS_1206]
SICDIODE1  C2M0280120D_C2M0280120D  [C2M0280120D_TO544P521X1594X2550-3P]
SICDIODE3  C2M0280120D_C2M0280120D  [C2M0280120D_TO544P521X1594X2550-3P]
SJ4  JUMPER_SJ  [JUMPER_SJ]
SJ8  JUMPER_SJ  [JUMPER_SJ]
SJ9  JUMPER_SJ  [JUMPER_SJ]
SJ10  JUMPER_SJ  [JUMPER_SJ]
SJ11  JUMPER_SJ  [JUMPER_SJ]
SJ12  JUMPER_SJ  [JUMPER_SJ]
TP3  TPTP15SQ  [TP15SQ]
TP7  TPTP15SQ  [TP15SQ]
TP8  TPTP15SQ  [TP15SQ]
TP9  TPTP15SQ  [TP15SQ]
TP10  TPTP15SQ  [TP15SQ]
U1  SAMACSYS_LIB_MGJ2D052005SC  [SAMACSYS_LIB_MGJ2D_7-PIN-SIP]
U4  SAMACSYS_LIB_MGJ2D052005SC  [SAMACSYS_LIB_MGJ2D_7-PIN-SIP]
U$1  SO24E-IC_STGAP1AS  [SO24E-IC_SO24W]
U$3  SO24E-IC_STGAP1AS  [SO24E-IC_SO24W]
X4  234-502  [234-502]
X5  234-502  [234-502]
X6  234-502  [234-502]

### Nets
/DIAG1_2: DL6.C J5.3 U$3.10(/DIAG1)
/DIAG12_2: DL8.C J6.2 U$1.10(/DIAG1)
CK_2: C63.1 C85.1 J6.3 J7.3 J8.3 U$1.5(CK) U$3.5(CK)
CS_2: C62.1 C84.1 J5.1 J7.2 J8.2 U$1.4(/CS) U$3.4(/CS)
DESAT2_2: C70.1 R45.1 U$1.18(DESAT)
DESAT_2: C44.1 R17.1 U$3.18(DESAT)
GND: C59.2 C60.2 C61.2 C62.2 C63.2 C64.2 C65.2 C66.2 C67.2 C81.2 C82.2 C83.2 C84.2 C85.2 C86.2 C87.2 C88.2 C89.2 J5.11 U1.2(-VIN) U4.2(-VIN) U$1.1(GND_SIG) U$1.12(GND_SIG) U$3.1(GND_SIG) U$3.12(GND_SIG) ; supply symbol labelled SUPPLY1_GND ; also sheet 1
GND_SIG2_2: C70.2 C71.2 C72.2 C73.2 C74.2 C75.2 C76.2 C77.2 C78.2 C79.2 C80.2 C92.2 C93.2 C94.2 Q4.3(S) R44.2 SICDIODE3.1(G) SICDIODE3.3(S) U4.6(0V) U$1.13(GNDISO) X6.A1(-1) X6.A2(-2)
GND_SIG_2: C44.2 C49.2 C50.2 C51.2 C52.2 C53.2 C54.2 C55.2 C56.2 C57.2 C58.2 C91.2 D9-D.N.M.1.1(K) D13.1(K) Q3.3(S) Q4.2(D) R15.2 R58.2 SICDIODE1.1(G) SICDIODE1.3(S) SICDIODE3.2(D) U1.6(0V) U$3.13(GNDISO) X5.A1(-1) X5.A2(-2)
GOFF2_2: R53.1 R54.1 U$1.21(GOFF)
GOFF_2: R40.1 R41.1 U$3.21(GOFF)
GON2_2: R55.1 R56.1 U$1.20(GON)
GON_2: R42.1 R43.1 U$3.20(GON)
IN+_2: DL7.C J5.4 R24.1 R50.1
IN+_PIN2_2: C87.1 R47.2 U$1.9(IN+)
IN+_PIN_2: C65.1 R24.2 U$3.9(IN+)
IN-/DIAG2_2: DL5.C J5.5 R27.1 R47.1
IN-/DIAG2_PIN2_2: C89.1 R50.2 U$1.8(IN-/DIAG2)
IN-/DIAG2_PIN_2: C67.1 R27.2 U$3.8(IN-/DIAG2)
N$6_2: D9.2(A) R17.2
N$8_2: D11.3(COM) Q3.1(G) R18.1 R29.1 R40.2 R41.2 R42.2 R43.2 TP7.TP U$3.22(CLAMP)
N$9_2: D12.1(K) R29.2
N$17_2: DL5.A R25.1
N$21_2: C93.1 C94.1 D9-D.N.M1.1(K) D9.1(K) Q3.2(D) R57.2 SICDIODE1.2(D) TP3.TP X4.A1(-1) X4.A2(-2)
N$22_2: DL6.A R26.1
N$24_2: D13.2(A) R45.2
N$25_2: D16.1(K) R52.2
N$26_2: R44.1 U$1.24(ASC)
N$27_2: DL7.A R48.1
N$29_2: DL8.A R49.1
N$30_2: D9-D.N.M1.2(A) D10.2(A) D12.2(A)
N$31_2: D10.1(K) R15-D.N.M1.1
N$33_2: D9-D.N.M.1.2(A) D14.2(A) D16.2(A)
N$34_2: D14.1(K) R1-D.N.M.1.1
N$35_2: C91.1 R57.1
N$36_2: C92.1 R58.1
N$37_2: R15.1 U$3.24(ASC)
N$82_2: D15.3(COM) Q4.1(G) R46.1 R52.1 R53.2 R54.2 R55.2 R56.2 TP8.TP U$1.22(CLAMP)
NONE_2: J6.1
SD_2: J5.2 R19.1
SD_PIN_2: C66.1 C88.1 J7.1 J8.1 R19.2 U$1.11(/SD) U$3.11(/SD)
SDI2_2: SJ8.2 SJ11.2
SDI_2: J5.9 SJ9.2
SDI_PIN2_2: C86.1 SJ11.1 U$1.3(SDI)
SDO_2: J5.10 SJ12.1
SDO_PIN2: C64.1 J7.4 SJ9.1 U$3.3(SDI) ; also sheet 1
SDO_PIN2_2: J8.4 SJ12.2 U$1.2(SDO)
SDO_PIN_2: SJ8.1 U$3.2(SDO)
SENSE2_2: C71.1 TP10.TP U$1.16(SENSE)
SENSE_2: C49.1 TP9.TP U$3.16(SENSE)
VCECLAMP2_2: R1-D.N.M.1.2 R51.2 U$1.19(VCECLAMP)
VCECLAMP_2: R15-D.N.M1.2 R28.2 U$3.19(VCECLAMP)
VDD: C61.1 C83.1 J5.8 J5.12 R25.2 R26.2 R48.2 R49.2 SJ4.2 SJ10.2 U1.1(+VIN) U4.1(+VIN) U$1.7(VDD) U$3.7(VDD) ; also sheet 1
VH2_2: C76.1 C78.1 C79.1 D15.2(K) U4.7(+VOUT) U$1.17(VH)
VH_2: C54.1 C56.1 C57.1 D11.2(K) U1.7(+VOUT) U$3.17(VH)
VL2_2: C74.1 C75.1 C77.1 C80.1 D15.1(A) R46.2 R51.1 U4.5(-VOUT) U$1.14(VL) U$1.23(VL)
VL_2: C52.1 C53.1 C55.1 C58.1 D11.1(A) R18.2 R28.1 U1.5(-VOUT) U$3.14(VL) U$3.23(VL)
VREG_2: C59.1 C60.1 C81.1 C82.1 SJ4.1 SJ10.1 U$1.6(VREG) U$3.6(VREG)
VREGISO2_2: C72.1 C73.1 U$1.15(VREGISO)
VREGISO_2: C50.1 C51.1 U$3.15(VREGISO)
Unconnected: J5.6 J5.7 X4.B1(B-1) X4.B2(B-2) X5.B1(B-1) X5.B2(B-2) X6.B1(B-1) X6.B2(B-2)

## Sheet 3 of 3

## Library data of the parts
C1 C2 C33 C57 C58 C80 = PCB_Design_board_compiled_ Four layer2:SPARKFUN-CAPACITORS_2.2UF: 2.2µF ceramic capacitors A capacitor is a passive two-terminal electrical component used to store electrical energy temporarily in an electric field.; PROD_ID: CAP-10009
C3 C5 C7 C10 C11 C16 C26-C29 C35 C36 C51-C54 C60 C61 C73-C76 C82 C83 = PCB_Design_board_compiled_ Four layer2:SPARKFUN-CAPACITORS_0.1UF: 0.1µF ceramic capacitors A capacitor is a passive two-terminal electrical component used to store electrical energy temporarily in an electric field.; PROD_ID: CAP-08390
C4 C6 C43 = PCB_Design_board_compiled_ Four layer2:SPARKFUN-CAPACITORS_10UF: 10.0µF ceramic capacitors A capacitor is a passive two-terminal electrical component used to store electrical energy temporarily in an electric field.; PROD_ID: CAP-09824
C8 C9 C13 C15 C20 C40-C42 C44-C46 C65-C67 C70 C87-C89 C91 C92 = PCB_Design_board_compiled_ Four layer2:SPARKFUN-CAPACITORS_100PF: 100pF/0.1nF ceramic capacitors A capacitor is a passive two-terminal electrical component used to store electrical energy temporarily in an electric field.; PROD_ID: CAP-07883
C12 C24 C49 C71 = PCB_Design_board_compiled_ Four layer2:SPARKFUN-CAPACITORS_1.0NF/1000PF: 1nF/1,000pF ceramic capacitors A capacitor is a passive two-terminal electrical component used to store electrical energy temporarily in an electric field.; PROD_ID: CAP-07886
C14 C19 C25 C34 C50 C59 C72 C81 = PCB_Design_board_compiled_ Four layer2:SPARKFUN-CAPACITORS_4.7UF: 4.7µF ceramic capacitors A capacitor is a passive two-terminal electrical component used to store electrical energy temporarily in an electric field.; PROD_ID: CAP-08280
C17 C18 C30 C31 C55 C56 C77 C78 = PCB_Design_board_compiled_ Four layer2:SPARKFUN-CAPACITORS_1.0UF: 1µF ceramic capacitors A capacitor is a passive two-terminal electrical component used to store electrical energy temporarily in an electric field.; PROD_ID: CAP-08064
C21-C23 C37-C39 C62-C64 C84-C86 = PCB_Design_board_compiled_ Four layer2:SPARKFUN-CAPACITORS_47PF: 47pF ceramic capacitors A capacitor is a passive two-terminal electrical component used to store electrical energy temporarily in an electric field.; PROD_ID: CAP-08913
C32 C79 = PCB_Design_board_compiled_ Four layer2:SPARKFUN-CAPACITORS_2.2UF: 2.2µF ceramic capacitors A capacitor is a passive two-terminal electrical component used to store electrical energy temporarily in an electric field.; PROD_ID: CAP-10009; SPICEPREFIX: C
C47 C48 C93 C94 = rcl:C-EU: CAPACITOR, European symbol; SPICEPREFIX: C
D1 D11 = PCB_Design_board_compiled_ Four layer2:BAT54SFILM_BAT54SFILM: BAT54SFILM, Schottky Diode, 0.3A max, 40V 5ns Dual, 3-Pin, SOT-23 Source: Datasheet <http://www.st.com/web/en/resource/technical/document/datasheet/CD00001322.pdf>; ALLIED_NUMBER: 70389803; DESCRIPTION: BAT54SFILM, Schottky Diode, 0.3A max, 40V 5ns Dual, 3-Pin, SOT-23; HEIGHT: 1.5mm; MANUFACTURER_NAME: STMicroelectronics; MANUFACTURER_PART_NUMBER: BAT54SFILM; RS_PART_NUMBER: 7146863P
D2 D5 D9 D13 = PCB_Design_board_compiled_ Four layer2:STTH112A_STTH112A: STTH112A, Fast Rectifier Diode, Switching 1A max, 1200V 75ns, 2-Pin, SMA Source: Datasheet <http://www.st.com/web/en/resource/technical/document/datasheet/CD00003260.pdf>; ALLIED_NUMBER: 70391556; DESCRIPTION: STTH112A, Fast Rectifier Diode, Switching 1A max, 1200V 75ns, 2-Pin, SMA; HEIGHT: 2.65mm; MANUFACTURER_NAME: STMicroelectronics; MANUFACTURER_PART_NUMBER: STTH112A; RS_PART_NUMBER: 0249319
D3 D9-D.N.M D9-D.N.M1 D12 = PCB_Design_board_compiled_ Four layer2:STPS2H100A_STPS2H100A: STPS2H100A, Schottky Diode, 2A max, 100V, 2-Pin, SMA Source: Datasheet <http://www.st.com/web/en/resource/technical/document/datasheet/CD00001548.pdf>; ALLIED_NUMBER: 70391466; DESCRIPTION: STPS2H100A, Schottky Diode, 2A max, 100V, 2-Pin, SMA; HEIGHT: 2.65mm; MANUFACTURER_NAME: STMicroelectronics; MANUFACTURER_PART_NUMBER: STPS2H100A; RS_PART_NUMBER: 0249612P
D4 D6 D10 D14 = PCB_Design_board_compiled_ Four layer2:BAT20JFILM_BAT20JFILM: BAT20JFILM, Schottky Diode, 1A max, 23V, 2-Pin, SOD-323 Source: Datasheet <http://www.st.com/web/en/resource/technical/document/datasheet/CD00012201.pdf>; ALLIED_NUMBER: 70389788; DESCRIPTION: BAT20JFILM, Schottky Diode, 1A max, 23V, 2-Pin, SOD-323; HEIGHT: 1.13mm; MANUFACTURER_NAME: STMicroelectronics; MANUFACTURER_PART_NUMBER: BAT20JFILM; RS_PART_NUMBER: 1657545
D7 D15 = PCB_Design_board_compiled_ Four layer2:BAT54SFILM_BAT54SFILM: BAT54SFILM, Schottky Diode, 0.3A max, 40V 5ns Dual, 3-Pin, SOT-23 Source: Datasheet <http://www.st.com/web/en/resource/technical/document/datasheet/CD00001322.pdf>; ALLIED_NUMBER: 70389803; DESCRIPTION: BAT54SFILM, Schottky Diode, 0.3A max, 40V 5ns Dual, 3-Pin, SOT-23; HEIGHT: 1.5mm; MANUFACTURER_NAME: STMicroelectronics; MANUFACTURER_PART_NUMBER: BAT54SFILM; RS_PART_NUMBER: 7146863P; SPICEPREFIX: J
D8 D9-D.N.M.1 D9-D.N.M.2 D16 = PCB_Design_board_compiled_ Four layer2:STPS2H100A_STPS2H100A: STPS2H100A, Schottky Diode, 2A max, 100V, 2-Pin, SMA Source: Datasheet <http://www.st.com/web/en/resource/technical/document/datasheet/CD00001548.pdf>; ALLIED_NUMBER: 70391466; DESCRIPTION: STPS2H100A, Schottky Diode, 2A max, 100V, 2-Pin, SMA; HEIGHT: 2.65mm; MANUFACTURER_NAME: STMicroelectronics; MANUFACTURER_PART_NUMBER: STPS2H100A; RS_PART_NUMBER: 0249612P; SPICEPREFIX: D
DL1-DL8 = PCB_Design_board_compiled_ Four layer2:SPARKFUN-LED_LED-RED: Red SMD LED Used in manufacturing of most products at SparkFun Packages: 0603 - SMD 0603 package [Product Link] <http://docs.avagotech.com/docs/AV02-0551EN> 0603 SMART - SMD 0603 SMART package ( more efficient and expensive)[Product Link] <http://www.osram-os.com/Graphics/XPic2/00077099_0.pdf> 1206 - SMD1206 package [Product Link] <https://www.sparkfun.com/datasheets/DevTools/LilyPad/Q150OVS4.pdff> SparkFun Products: Pro Mini 328 -5V <https://www.sparkfun.com/products/821> RedBoard <https://www.sparkfun.com/products/12757> IOIO-OTG <https://www.sparkfun.com/products/13613>; PROD_ID: DIO-09912
IC1 = PCB_Design_board_compiled_ Four layer2:NATIONAL-SEMICONDUCTOR_LM2936MP?*: Ultra-Low Quiescent Current LDO Voltage Regulator Source: Data sheet <http://www.national.com/ds/LM/LM2936.pdf>; MF: NATIONAL SEMICONDUCTOR; MPN: LM2936MP-3.0/NOPB; OC_FARNELL: 1496125; OC_NEWARK: 41K4522
J1 J5 = PCB_Design_board_compiled_ Four layer2:SPARKFUN-CONNECTORS_CONN_12: Multi connection point. Often used as Generic Header-pin footprint for 0.1 inch spaced/style header connections On any of the 0.1 inch spaced packages, you can populate with these: Break Away Headers - Straight <https://www.sparkfun.com/products/116> (PRT-00116) Break Away Male Headers - Right Angle <https://www.sparkfun.com/products/553> (PRT-00553) Female Headers <https://www.sparkfun.com/products/115> (PRT-00115) Break Away Headers - Machine Pin <https://www.sparkfun.com/products/117> (PRT-00117) Break Away Female Headers - Swiss Machine Pin <https://www.sparkfun.com/products/743> (PRT-00743) For SCREWTERMINALS and SPRING TERMINALS visit here: Screw Terimnals on SparkFun.com <https://www.sparkfun.com/search/results?term=Screw+Terminals> (5mm/3.5mm/2.54mm spacing) This device is also useful as a general connection point to wire up your design to another part of your project. Our various solder wires solder well into these plated through hole pads. Hook-Up Wire - Assortment (Stranded, 22 AWG) <https://www.sparkfun.com/products/11375> (PRT-11375) Hook-Up Wire - Assortment (Solid Core, 22 AWG) <https://www.sparkfun.com/products/11367> (PRT-11367) View the entire wire category on our website here <https://www.sparkfun.com/categories/141> Special notes: Molex polarized connector foot print use with SKU : PRT-08231 with associated crimp pins and housings. 1MM SMD Version SKU: PRT-10208 NOTES ON THE VARIANTS LOCK and LOCK_LONGPADS... This footprint was designed to help hold the alignment of a through-hole component (i.e. 6-pin header) while soldering it into place. You may notice that each hole has been shifted either up or down by 0.005 of an inch from it's more standard position (which is a perfectly straight line). This slight alteration caused the pins (the squares in the middle) to touch the edges of the holes. Because they are alternating, it causes a "brace" to hold the component in place. 0.005 has proven to be the perfect amount of "off-center" position when using our standard breakaway headers. Although looks a little odd when you look at the bare footprint, once you have a header in there, the alteration is very hard to notice. Also,if you push a header all the way into place, it is covered up entirely on the bottom side.
J2 J6 = PCB_Design_board_compiled_ Four layer2:SPARKFUN-CONNECTORS_CONN_03: Multi connection point. Often used as Generic Header-pin footprint for 0.1 inch spaced/style header connections On any of the 0.1 inch spaced packages, you can populate with these: Break Away Headers - Straight <https://www.sparkfun.com/products/116> (PRT-00116) Break Away Male Headers - Right Angle <https://www.sparkfun.com/products/553> (PRT-00553) Female Headers <https://www.sparkfun.com/products/115> (PRT-00115) Break Away Headers - Machine Pin <https://www.sparkfun.com/products/117> (PRT-00117) Break Away Female Headers - Swiss Machine Pin <https://www.sparkfun.com/products/743> (PRT-00743) Stackable Header - 3 Pin (Female, 0.1") <https://www.sparkfun.com/products/13875> (PRT-13875) For SCREWTERMINALS and SPRING TERMINALS visit here: Screw Terimnals on SparkFun.com <https://www.sparkfun.com/search/results?term=Screw+Terminals> (5mm/3.5mm/2.54mm spacing) This device is also useful as a general connection point to wire up your design to another part of your project. Our various solder wires solder well into these plated through hole pads. Hook-Up Wire - Assortment (Stranded, 22 AWG) <https://www.sparkfun.com/products/11375> (PRT-11375) Hook-Up Wire - Assortment (Solid Core, 22 AWG) <https://www.sparkfun.com/products/11367> (PRT-11367) View the entire wire category on our website here <https://www.sparkfun.com/categories/141> Special notes: Molex polarized connector foot print use with SKU : PRT-08232 with associated crimp pins and housings.
J3 J4 J7 J8 = PCB_Design_board_compiled_ Four layer2:SPARKFUN-CONNECTORS_CONN_04: Multi connection point. Often used as Generic Header-pin footprint for 0.1 inch spaced/style header connections On any of the 0.1 inch spaced packages, you can populate with these: Break Away Headers - Straight <https://www.sparkfun.com/products/116> (PRT-00116) Break Away Male Headers - Right Angle <https://www.sparkfun.com/products/553> (PRT-00553) Female Headers <https://www.sparkfun.com/products/115> (PRT-00115) Break Away Headers - Machine Pin <https://www.sparkfun.com/products/117> (PRT-00117) Break Away Female Headers - Swiss Machine Pin <https://www.sparkfun.com/products/743> (PRT-00743) For SCREWTERMINALS and SPRING TERMINALS visit here: Screw Terimnals on SparkFun.com <https://www.sparkfun.com/search/results?term=Screw+Terminals> (5mm/3.5mm/2.54mm spacing) This device is also useful as a general connection point to wire up your design to another part of your project. Our various solder wires solder well into these plated through hole pads. Hook-Up Wire - Assortment (Stranded, 22 AWG) <https://www.sparkfun.com/products/11375> (PRT-11375) Hook-Up Wire - Assortment (Solid Core, 22 AWG) <https://www.sparkfun.com/products/11367> (PRT-11367) View the entire wire category on our website here <https://www.sparkfun.com/categories/141> Special notes: Molex polarized connector foot print use with SKU : PRT-08231 with associated crimp pins and housings. 1MM SMD Version SKU: PRT-10208; PROD_ID: CONN-09696
MICROCONTROLLER_POWER1 = PCB_Design_board_compiled_ Four layer2:SPARKFUN-CONNECTORS_CONN_02: Multi connection point. Often used as Generic Header-pin footprint for 0.1 inch spaced/style header connections On any of the 0.1 inch spaced packages, you can populate with these: Break Away Headers - Straight <https://www.sparkfun.com/products/116> (PRT-00116) Break Away Male Headers - Right Angle <https://www.sparkfun.com/products/553> (PRT-00553) Female Headers <https://www.sparkfun.com/products/115> (PRT-00115) Break Away Headers - Machine Pin <https://www.sparkfun.com/products/117> (PRT-00117) Break Away Female Headers - Swiss Machine Pin <https://www.sparkfun.com/products/743> (PRT-00743) For SCREWTERMINALS and SPRING TERMINALS visit here: Screw Terimnals on SparkFun.com <https://www.sparkfun.com/search/results?term=Screw+Terminals> (5mm/3.5mm/2.54mm spacing) This device is also useful as a general connection point to wire up your design to another part of your project. Our various solder wires solder well into these plated through hole pads. Hook-Up Wire - Assortment (Stranded, 22 AWG) <https://www.sparkfun.com/products/11375> (PRT-11375) Hook-Up Wire - Assortment (Solid Core, 22 AWG) <https://www.sparkfun.com/products/11367> (PRT-11367) View the entire wire category on our website here <https://www.sparkfun.com/categories/141> Special notes: Molex polarized connector foot print use with: PRT-08233 with associated crimp pins and housings. 2.54_SCREWTERM for use with PRT-10571. 3.5mm Screw Terminal footprints for PRT-08084 5mm Screw Terminal footprints for use with PRT-08432; SF_SKU: PRT-08432
Q1-Q4 SICDIODE SICDIODE1-SICDIODE3 = PCB_Design_board_compiled_ Four layer2:C2M0280120D_C2M0280120D: N-chan SiC MOSFET 1200V 10A TO247 Source: Datasheet <http://docs-asia.electrocomponents.com/webdocs/149f/0900766b8149fd3e.pdf>; DESCRIPTION: N-chan SiC MOSFET 1200V 10A TO247; HEIGHT: 5.21mm; MANUFACTURER_NAME: Wolfspeed; MANUFACTURER_PART_NUMBER: C2M0280120D; RS_PART_NUMBER: 9158820P
R1 R8 R10 R15 R17 R22 R44 R45 = PCB_Design_board_compiled_ Four layer2:SPARKFUN-RESISTORS_1KOHM: 1kΩ resistor A resistor is a passive two-terminal electrical component that implements electrical resistance as a circuit element. Resistors act to reduce current flow, and, at the same time, act to lower voltage levels within circuits. - Wikipedia; PROD_ID: RES-07856
R1-D.N.M.1 R1-D.N.M.2 R9 R15-D.N.M R15-D.N.M1 R28 R34 R51 = PCB_Design_board_compiled_ Four layer2:SPARKFUN-RESISTORS_0OHM: 0Ω resistor A resistor is a passive two-terminal electrical component that implements electrical resistance as a circuit element. Resistors act to reduce current flow, and, at the same time, act to lower voltage levels within circuits. - Wikipedia; PROD_ID: RES-08609
R2-R6 R11 R14 R20 R21 R25 R26 R29 R31 R32 R35-R43 R48 R49 R52-R58 = PCB_Design_board_compiled_ Four layer2:SPARKFUN-RESISTORS_RESISTOR: Generic Resistor Package
R7 R18 R23 R46 = PCB_Design_board_compiled_ Four layer2:SPARKFUN-RESISTORS_47KOHM: 47kΩ resistor A resistor is a passive two-terminal electrical component that implements electrical resistance as a circuit element. Resistors act to reduce current flow, and, at the same time, act to lower voltage levels within circuits. - Wikipedia; PROD_ID: RES-07871
R12 R13 R16 R19 R24 R27 R30 R33 R47 R50 = PCB_Design_board_compiled_ Four layer2:SPARKFUN-RESISTORS_100OHM: 100Ω resistor A resistor is a passive two-terminal electrical component that implements electrical resistance as a circuit element. Resistors act to reduce current flow, and, at the same time, act to lower voltage levels within circuits. - Wikipedia; PROD_ID: RES-12438
SJ1-SJ12 = PCB_Design_board_compiled_ Four layer2:JUMPER_SJ: SMD solder JUMPER
TP1-TP10 = testpad:TP: Test pad
U1-U4 = PCB_Design_board_compiled_ Four layer2:SAMACSYS_LIB_MGJ2D052005SC: Murata Power Solutions 2W Isolated DC-DC Converter, Vin 4.5 5.5 V, Vout 20 V, -5 V, I/O isolation 5200V dc Source: Datasheet <http://power.murata.com/data/power/ncl/kdc_mgj2.pdf>; ARROW_PART_NUMBER: MGJ2D052005SC; DESCRIPTION: Murata Power Solutions 2W Isolated DC-DC Converter, Vin 4.5 5.5 V, Vout 20 V, -5 V, I/O isolation 5200V dc; HEIGHT: mm; MANUFACTURER_NAME: Murata Electronics; MANUFACTURER_PART_NUMBER: MGJ2D052005SC; RS_PART_NUMBER: 8163506P
U$1-U$3 U$5 = PCB_Design_board_compiled_ Four layer2:SO24E-IC_STGAP1AS
X1-X6 = con-wago255:234-502: WAGO; MPN: 234-502; OC_FARNELL: 1777106; OC_NEWARK: 28K9105

## Net classes
0 default: width 0.1 mm, drill 0.2 mm, clearance 0.003 mm